# EAGLE design PS2Encoder_v3 (EAGLE 5.11)
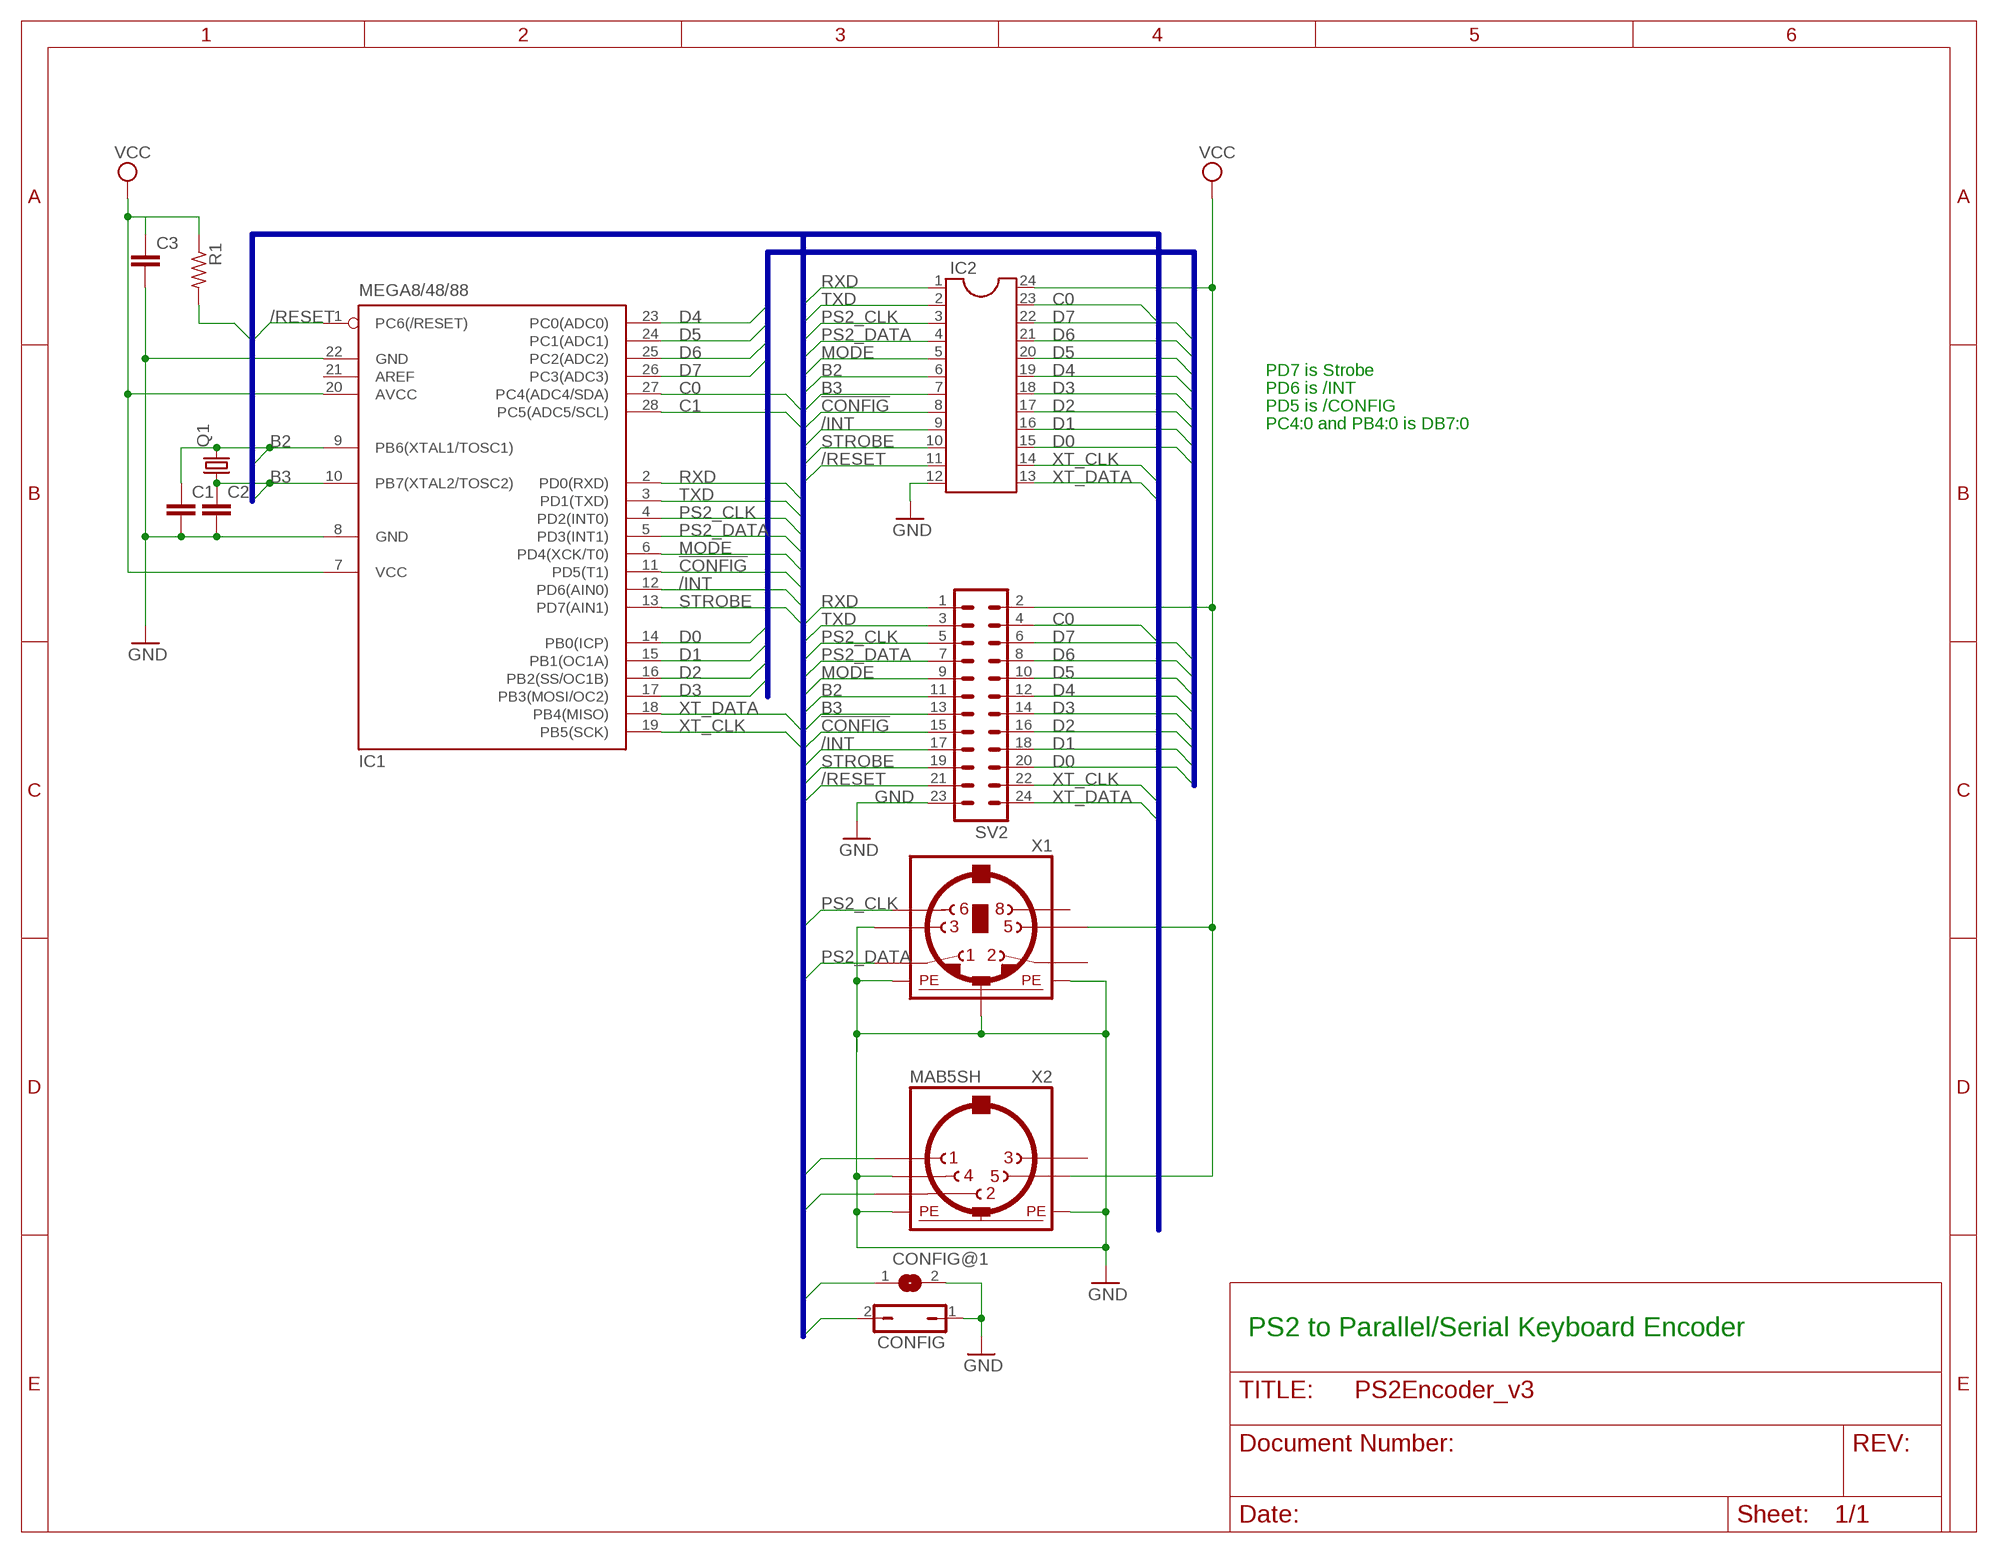
[diagram p0: schematic, sheet 1]

## Parts
C1  C-EU025-024X044  [C025-024X044]
C2  C-EU025-024X044  [C025-024X044]
C3  C-EU025-024X044  [C025-024X044]
CONFIG  JP1Q  [JP1]
CONFIG@1  SJ  [SJ]
IC1  MEGA8/48/88  MEGA8-P  [DIL28-3]
IC2  DIL24-6  [DIL24-6]
Q1  CRYSTALHC49U-V  [HC49U-V]
R1  R-US_0204/2V  [0204V]
SV2  MA12-2  [MA12-2]
X1  MINI_DIN_6  [M_DIN6]
X2  MAB5SH  [MAB5SH]

## Nets
!CONFIG: CONFIG.2 CONFIG@1.1 IC1.11(PD5(T1)) IC2.8 SV2.15
/INT: IC1.12(PD6(AIN0)) IC2.9 SV2.17
/RESET: IC1.1(PC6(/RESET)) IC2.11 R1.2 SV2.21
B2: C1.1 IC1.9(PB6(XTAL1/TOSC1)) IC2.6 Q1.2 SV2.11
B3: C2.1 IC1.10(PB7(XTAL2/TOSC2)) IC2.7 Q1.1 SV2.13
C0: IC1.27(PC4(ADC4/SDA)) IC2.23 SV2.4
C1: IC1.28(PC5(ADC5/SCL))
D0: IC1.14(PB0(ICP)) IC2.15 SV2.20
D1: IC1.15(PB1(OC1A)) IC2.16 SV2.18
D2: IC1.16(PB2(SS/OC1B)) IC2.17 SV2.16
D3: IC1.17(PB3(MOSI/OC2)) IC2.18 SV2.14
D4: IC1.23(PC0(ADC0)) IC2.19 SV2.12
D5: IC1.24(PC1(ADC1)) IC2.20 SV2.10
D6: IC1.25(PC2(ADC2)) IC2.21 SV2.8
D7: IC1.26(PC3(ADC3)) IC2.22 SV2.6
GND: C1.2 C2.2 C3.2 CONFIG.1 CONFIG@1.2 IC1.8(GND) IC1.22(GND) IC2.12 SV2.23 X1.3 X1.SH1(PE1) X1.SH2(PE2) X1.SH3(PE3) X2.4 X2.PE X2.PE@(PE)
MODE: IC1.6(PD4(XCK/T0)) IC2.5 SV2.9
PS2_CLK: IC1.4(PD2(INT0)) IC2.3 SV2.5 X1.6
PS2_DATA: IC1.5(PD3(INT1)) IC2.4 SV2.7 X1.1
RXD: IC1.2(PD0(RXD)) IC2.1 SV2.1
STROBE: IC1.13(PD7(AIN1)) IC2.10 SV2.19
TXD: IC1.3(PD1(TXD)) IC2.2 SV2.3
VCC: C3.1 IC1.7(VCC) IC1.20(AVCC) IC2.24 R1.1 SV2.2 X1.5 X2.5
XT_CLK: IC1.19(PB5(SCK)) IC2.14 SV2.22 X2.1
XT_DATA: IC1.18(PB4(MISO)) IC2.13 SV2.24 X2.2
Unconnected: IC1.21(AREF) X1.2 X1.8 X2.3

## Buses
D[0..7]
/RESET,RXD,TXD,/CONFIG,STROBE,/INT,B2,B3,C0,C1,CLK,DATA,/AUX,XT_CLK,XT_DATA

## Notes on the sheet
- PD7 is Strobe
- PD6 is /INT
- PD5 is /CONFIG
- PC4:0 and PB4:0 is DB7:0
- PS2 to Parallel/Serial Keyboard Encoder

## Library data of the parts
C1-C3 = rcl:C-EU: CAPACITOR, European symbol
CONFIG = jumper:JP1Q: JUMPER
CONFIG@1 = jumper:SJ: SMD solder JUMPER
IC1 = atmel:MEGA8-P: MICROCONTROLLER 8 Kbytes FLASH, 1 kbytes SRAM, 512 bytes EEPROM, USART, 4-channel 10 bit ADC, 2-channel 8 bit ADC Pin compatible with Atmega48, ATMega88, ATMega168 Source: avr.lbr; OC_FARNELL: unknown; OC_NEWARK: unknown
IC2 = ic-package-rp:DIL24: Dual In Line
Q1 = crystal:CRYSTAL: CRYSTAL; OC_FARNELL: 1666969; OC_NEWARK: unknown
R1 = resistor:R-US_: RESISTOR, American symbol
SV2 = con-lstb:MA12-2: PIN HEADER; OC_FARNELL: unknown; OC_NEWARK: unknown
X1 = mini_din:MINI_DIN_6
X2 = con-hirschmann:MAB5SH: Female CONNECTOR 5 pins 90 deg. with shield, horizontal (DIN 41524); OC_FARNELL: 809883; OC_NEWARK: unknown

## Board
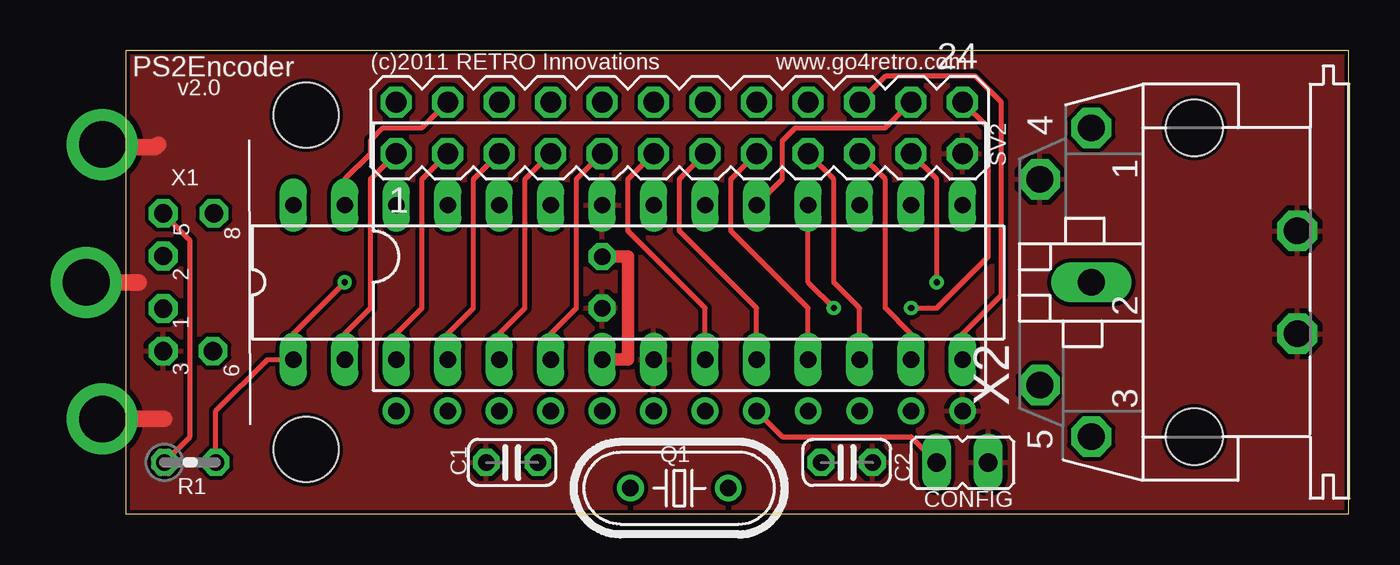
[diagram p1: board, top side]
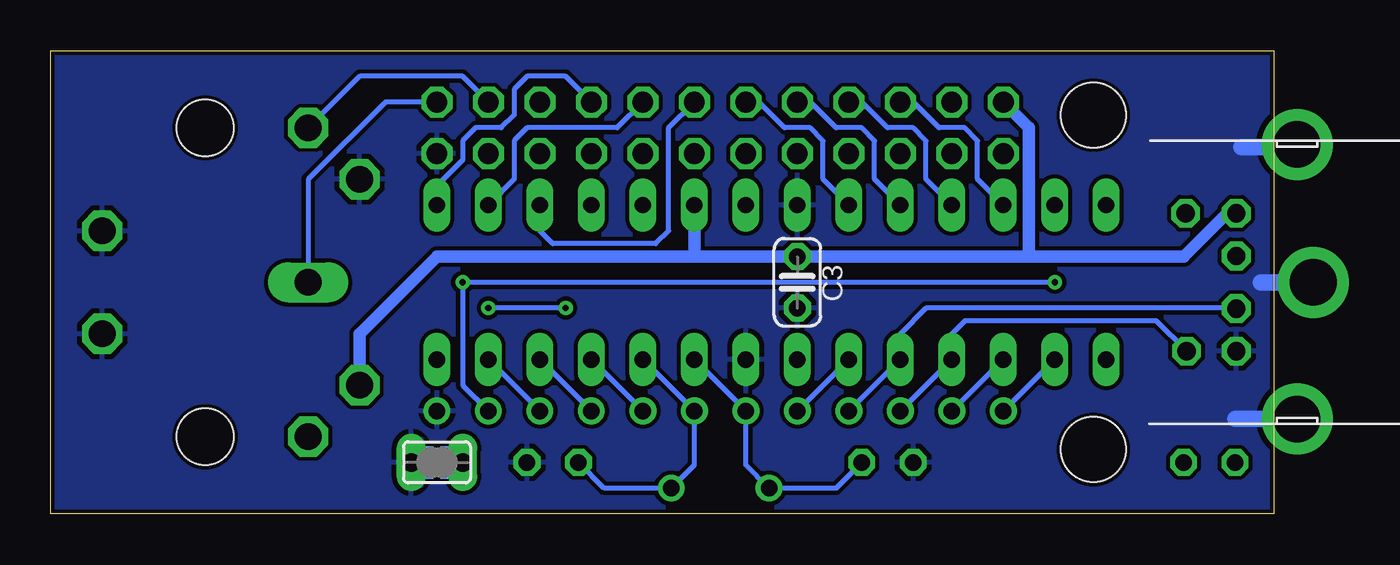
[diagram p2: board, bottom side, seen from below]

Size 60.33 x 22.86 mm. Coordinates in mm from the lower left corner, seen from the top.
Outline: 60.33,0 60.33,22.86 0,22.86 0,0 60.33,0
Copper layers (1*16): Top 0.035mm / dielectric 1.5mm / Bottom 0.035mm
Design rules "default *": minimum track width 10mil, minimum drill 12mil, track to track 8mil, track to pad 8mil, pad to pad 8mil, via to via 8mil, smd to smd 8mil, copper to edge 8mil, drill to drill 8mil, minimum pad ring 10mil, minimum via ring 8mil, stop-mask expansion 4mil, vias tented up to drill 0mil, thermal gap 10mil
Holes 3.2 mm at 8.89,19.68 8.89,3.17

### Footprints (pad centres in the part's own frame; a part is rotated, then mirrored left to right if it is on the bottom)
C025-024X044 = drill 0.813 octagon: 1 -1.27,0; 2 1.27,0
JP1 = drill 0.914 long: 1 0,-1.27; 2 0,1.27
SJ = smd 1.168 x 1.6: 1 -0.762,0; 2 0.762,0
DIL28-3 = drill 0.813 long: 1 -16.51,-3.81; 2 -13.97,-3.81; 3 -11.43,-3.81; 4 -8.89,-3.81; 5 -6.35,-3.81; 6 -3.81,-3.81; 7 -1.27,-3.81; 8 1.27,-3.81; 9 3.81,-3.81; 10 6.35,-3.81; 11 8.89,-3.81; 12 11.43,-3.81; 13 13.97,-3.81; 14 16.51,-3.81; 15 16.51,3.81; 16 13.97,3.81; 17 11.43,3.81; 18 8.89,3.81; 19 6.35,3.81; 20 3.81,3.81; 21 1.27,3.81; 22 -1.27,3.81; 23 -3.81,3.81; 24 -6.35,3.81; 25 -8.89,3.81; 26 -11.43,3.81; 27 -13.97,3.81; 28 -16.51,3.81
DIL24-6 = drill 0.813 round: 1 -13.97,-7.62; 2 -11.43,-7.62; 3 -8.89,-7.62; 4 -6.35,-7.62; 5 -3.81,-7.62; 6 -1.27,-7.62; 7 1.27,-7.62; 8 3.81,-7.62; 9 6.35,-7.62; 10 8.89,-7.62; 11 11.43,-7.62; 12 13.97,-7.62; 13 13.97,7.62; 14 11.43,7.62; 15 8.89,7.62; 16 6.35,7.62; 17 3.81,7.62; 18 1.27,7.62; 19 -1.27,7.62; 20 -3.81,7.62; 21 -6.35,7.62; 22 -8.89,7.62; 23 -11.43,7.62; 24 -13.97,7.62
HC49U-V = drill 0.813 round: 1 -2.413,0; 2 2.413,0
0204V = drill 0.813 octagon: 1 -1.27,0; 2 1.27,0
MA12-2 = drill 1.016 octagon: 1 -13.97,-1.27; 2 -13.97,1.27; 3 -11.43,-1.27; 4 -11.43,1.27; 5 -8.89,-1.27; 6 -8.89,1.27; 7 -6.35,-1.27; 8 -6.35,1.27; 9 -3.81,-1.27; 10 -3.81,1.27; 11 -1.27,-1.27; 12 -1.27,1.27; 13 1.27,-1.27; 14 1.27,1.27; 15 3.81,-1.27; 16 3.81,1.27; 17 6.35,-1.27; 18 6.35,1.27; 19 8.89,-1.27; 20 8.89,1.27; 21 11.43,-1.27; 22 11.43,1.27; 23 13.97,-1.27; 24 13.97,1.27
M_DIN6 = drill 0.9 pad 1.422 octagon: 1 -1.3,-3.75; 2 1.3,-3.75; 3 -3.4,-3.75; 5 3.4,-3.75; 6 -3.4,-6.2; 8 3.4,-6.25 | drill 2.3 pad 3.5 round: SH1 6.8,-0.75; SH2 0,0.05; SH3 -6.75,-0.75
MAB5SH = drill 1.321 octagon: 1 7.62,5.08; 3 -7.62,5.08; 4 5.08,7.62; 5 -5.08,7.62; PE -2.54,-5.08; PE@ 2.54,-5.08 | drill 1.321 long: 2 0,5.08 | hole 2.794: 7.62,0; -7.62,0

### Placement (x,y rotation side)
C1  19.05,2.54 180 top
C2  35.56,2.54 0 top
C3  23.49,11.43 270 bottom
CONFIG  41.27,2.54 90 top
CONFIG@1  41.27,2.54 180 bottom
IC1  24.76,11.43 0 top
IC2  27.3,12.7 0 top
Q1  27.3,1.27 180 top
R1  3.17,2.54 0 top
SV2  27.3,19.05 0 top
X1  -1.91,11.43 90 top
X2  52.71,11.43 90 top

### Tracks (layer width: path | path; a pad name or v marks a point on that pad's centre or on a via)
!CONFIG
  Top 0.254: SV2.15 29.84,16.51 29.84,13.97 33.66,10.16 IC1.11 | CONFIG.2 38.73,3.81 32.39,3.81 IC2.8
  Bottom 0.254: IC2.8 IC1.11 | CONFIG.2 CONFIG@1.1
/INT
  Top 0.254: IC1.12 36.2,10.16 34.93,11.43 34.93,16.51 SV2.17
  Bottom 0.254: IC2.9 IC1.12
/RESET  (via drill 0.3)
  Top 0.254: v40.01,11.43 40.01,16.51 SV2.21 | v10.79,11.43 8.26,8.89 IC1.1 6.99,7.62 4.45,5.08 R1.2
  Bottom 0.254: IC2.11 40.01,6.35 v40.01,11.43 v10.79,11.43
B2
  Top 0.254: SV2.11 24.76,16.51 24.76,13.97 28.57,10.16 IC1.9
  Bottom 0.254: IC1.9 IC2.6 26.04,2.41 Q1.2 21.59,1.27 C1.1
B3
  Top 0.254: SV2.13 27.3,16.51 27.3,13.97 31.11,10.16 IC1.10
  Bottom 0.254: IC1.10 IC2.7 28.57,2.41 Q1.1 33.02,1.27 C2.1
C0
  Top 0.254: IC1.27 10.79,16.51 12.06,17.78 12.06,18.41 12.7,19.05 14.61,19.05 SV2.4
D0
  Top 0.254: IC1.14 41.27,8.89 43.18,10.79 43.18,20.32 41.91,21.59 37.47,21.59 SV2.20
D1
  Bottom 0.254: IC1.15 41.27,16.19 40.01,17.46 40.01,18.41 39.37,19.05 38.1,19.05 37.47,19.68 37.47,20.95 36.83,21.59 34.93,21.59 SV2.18
D2
  Bottom 0.254: IC1.16 37.47,16.51 37.47,18.41 36.83,19.05 32.39,19.05 SV2.16
D3
  Bottom 0.254: IC1.17 36.2,13.97 35.56,13.34 30.48,13.34 29.84,13.97 29.84,19.05 SV2.14
D4
  Bottom 0.254: IC1.23 22.22,16.51 22.22,18.41 22.86,19.05 24.13,19.05 25.4,20.32 SV2.12
D5
  Bottom 0.254: IC1.24 19.68,16.51 19.68,18.41 20.32,19.05 21.59,19.05 22.86,20.32 SV2.10
D6
  Bottom 0.254: IC1.25 17.14,16.51 17.14,18.41 17.78,19.05 19.05,19.05 20.32,20.32 SV2.8
D7
  Bottom 0.254: IC1.26 14.61,16.51 14.61,18.41 15.24,19.05 16.51,19.05 17.78,20.32 SV2.6
GND
  Top 0.813: -1.91,11.43 0.64,11.43 | 1.91,4.68 -1.27,4.68 -1.27,4.45 | 1.59,18.23 1.45,18.1 -1.27,18.1
  Bottom 0.813: X1.SH2 0.64,11.43 | X1.SH3 1.91,4.68 | -1.27,18.1 1.59,18.1
  pour Bottom: 0,0 60.33,0 60.33,22.86 0,22.86
  pour Top: 0,0 60.33,0 60.33,22.86 0,22.86
MODE
  Top 0.254: SV2.9 22.22,16.51 22.22,10.16 20.95,8.89 IC1.6
  Bottom 0.254: IC2.5 IC1.6
PS2_CLK
  Top 0.254: SV2.5 17.14,16.51 17.14,10.16 15.88,8.89 IC1.4
  Bottom 0.254: X1.6 5.79,9.53 15.24,9.53 15.88,8.89 IC1.4 IC2.3
PS2_DATA
  Top 0.254: SV2.7 19.68,16.51 19.68,10.16 18.41,8.89 IC1.5
  Bottom 0.254: X1.1 1.87,10.16 17.14,10.16 18.41,8.89 IC1.5 IC2.4
RXD
  Top 0.254: SV2.1 12.06,16.51 12.06,10.16 10.79,8.89 IC1.2
  Bottom 0.254: IC2.1 IC1.2
STROBE
  Top 0.254: IC1.13 38.73,8.89 37.47,10.16 37.47,16.51 SV2.19
  Bottom 0.254: IC2.10 IC1.13
TXD
  Top 0.254: SV2.3 14.61,16.51 14.61,10.16 13.34,8.89 IC1.3
  Bottom 0.254: IC2.2 IC1.3
VCC
  Top 0.254: R1.1 3.17,3.81 3.17,13.5 X1.5
  Top 0.61: IC1.7 24.76,7.62 24.76,12.7 C3.1
  Bottom 0.61: 28.57,12.7 IC1.20 | SV2.2 12.06,19.05 12.06,12.7 | 12.06,12.7 C3.1 28.57,12.7 | X1.5 2.32,14.83 4.45,12.7 12.06,12.7 | 28.57,12.7 41.27,12.7 45.09,8.89 X2.5
XT_CLK
  Top 0.254: IC1.19 32.39,16.51 32.39,18.41 33.02,19.05 37.47,19.05 SV2.22
  Bottom 0.254: X2.1 45.09,21.59 40.01,21.59 SV2.22
XT_DATA  (via drill 0.3)
  Top 0.254: IC1.18 33.66,11.43 v34.93,10.16 | v38.73,10.16 40.01,10.16 42.55,12.7 42.55,19.05 SV2.24
  Bottom 0.254: v34.93,10.16 v38.73,10.16 | X2.2 47.62,16.51 43.82,20.32 SV2.24

### Text on the board
tNames: PS2Encoder | (c)2011 RETRO Innovations | www.go4retro.com | v2.0